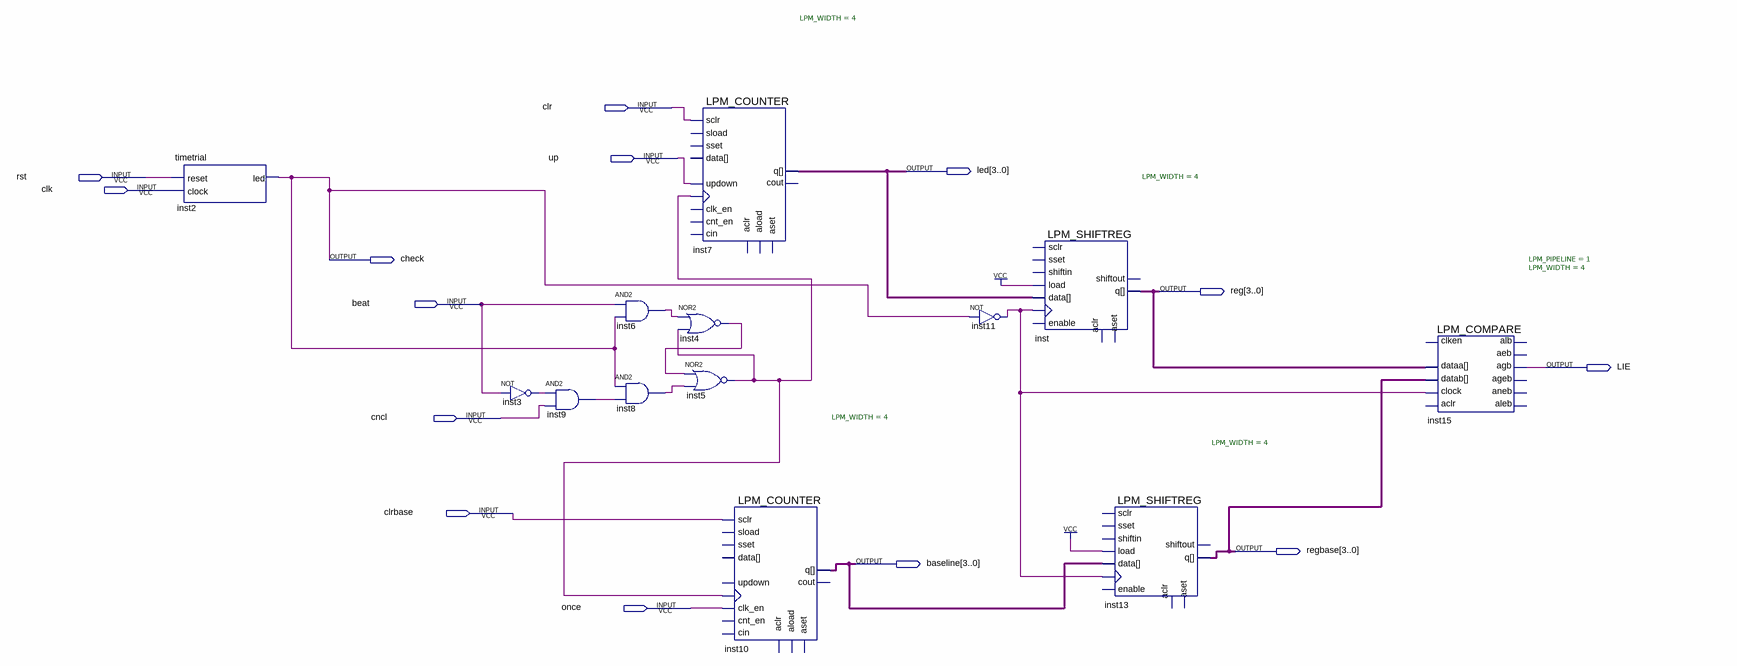
[diagram p0: schematic sheet]
// Quartus schematic startover.bdf as structural Verilog: 13 symbols, 14 pins
module startover (
  input  clr,
  input  up,
  input  rst,
  input  clk,
  input  beat,
  input  cncl,
  input  clrbase,
  input  once,
  output [3:0] led,
  output check,
  output [3:0] \reg ,
  output LIE,
  output [3:0] regbase,
  output [3:0] baseline
);

  wire inst3_out, inst4_out, inst5_out, inst6_out, inst8_out, inst9_out, inst11_out;

  timetrial inst2 (.reset(rst), .clock(clk), .led(check));
  not inst3 (inst3_out, beat);
  and inst9 (inst9_out, inst3_out, cncl);
  and inst6 (inst6_out, beat, check);
  and inst8 (inst8_out, check, inst9_out);
  LPM_COUNTER #(.LPM_WIDTH(4)) inst7 (
    .clock(inst5_out), .updown(up), .sclr(clr), .q(led));  // open: sload, data, clk_en, aload, aclr, aset, cin, sset, cnt_en, cout
  nor inst4 (inst4_out, inst6_out, inst5_out);
  nor inst5 (inst5_out, inst4_out, inst8_out);
  LPM_COUNTER #(.LPM_WIDTH(4)) inst10 (
    .clock(inst5_out), .clk_en(once), .sclr(clrbase), .q(baseline));  // open: sload, data, aload, aclr, aset, cin, sset, updown, cnt_en, cout
  not inst11 (inst11_out, check);
  LPM_SHIFTREG #(.LPM_WIDTH(4)) inst (
    .clock(inst11_out), .data(led), .load(1'b1), .q(\reg ));  // open: shiftin, sset, enable, sclr, aset, aclr, shiftout
  LPM_SHIFTREG #(.LPM_WIDTH(4)) inst13 (
    .clock(inst11_out), .data(baseline), .load(1'b1), .q(regbase));  // open: shiftin, sset, enable, sclr, aset, aclr, shiftout
  LPM_COMPARE #(.LPM_PIPELINE(1), .LPM_WIDTH(4)) inst15 (
    .dataa(\reg ), .datab(regbase), .clock(inst11_out), .agb(LIE));  // open: aclr, clken, aleb, aeb, aneb, ageb, alb
endmodule
